# EAGLE schematic stromversorgung_prinzip (EAGLE 6.5.0)
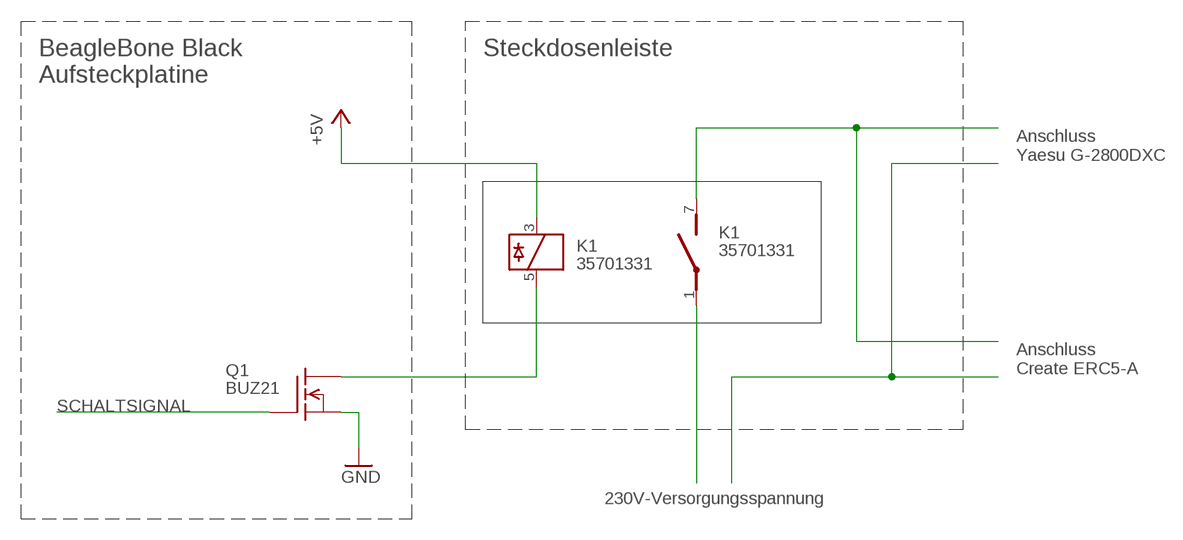
[diagram p0: schematic, sheet 1]

## Parts
K1  35701331  [REED]
Q1  BUZ21  [TO220]

## Nets
+5V: K1.3
GND: Q1.3(S)
N$1: K1.1(2:P)
N$2: K1.5 Q1.2(D)
N$4: K1.7(2:S)
SCHALTSIGNAL: Q1.1(G)

## Notes on the sheet
- BeagleBone Black
  Aufsteckplatine
- Steckdosenleiste
- Anschluss
  Yaesu G-2800DXC
- Anschluss
  Create ERC5-A
- 230V-Versorgungsspannung

## Library data of the parts
K1 = relay:35701331: RELAY reed, 1 x norm. open with polarity; OC_FARNELL: unknown; OC_NEWARK: unknown
Q1 = transistor-fet:BUZ21: N-Channel Enhancement MOSFET 100V; 19A; 0,1Ohm